# EAGLE design Classic-Narrow-5V-SIDE-USB (EAGLE 7.5.0)
Title: Classic Narrow 5V - Side USB Author: Lance Source: Alienflight.com License: CC BY SA <http://creativecommons.org/licenses/by-sa/4.0/>
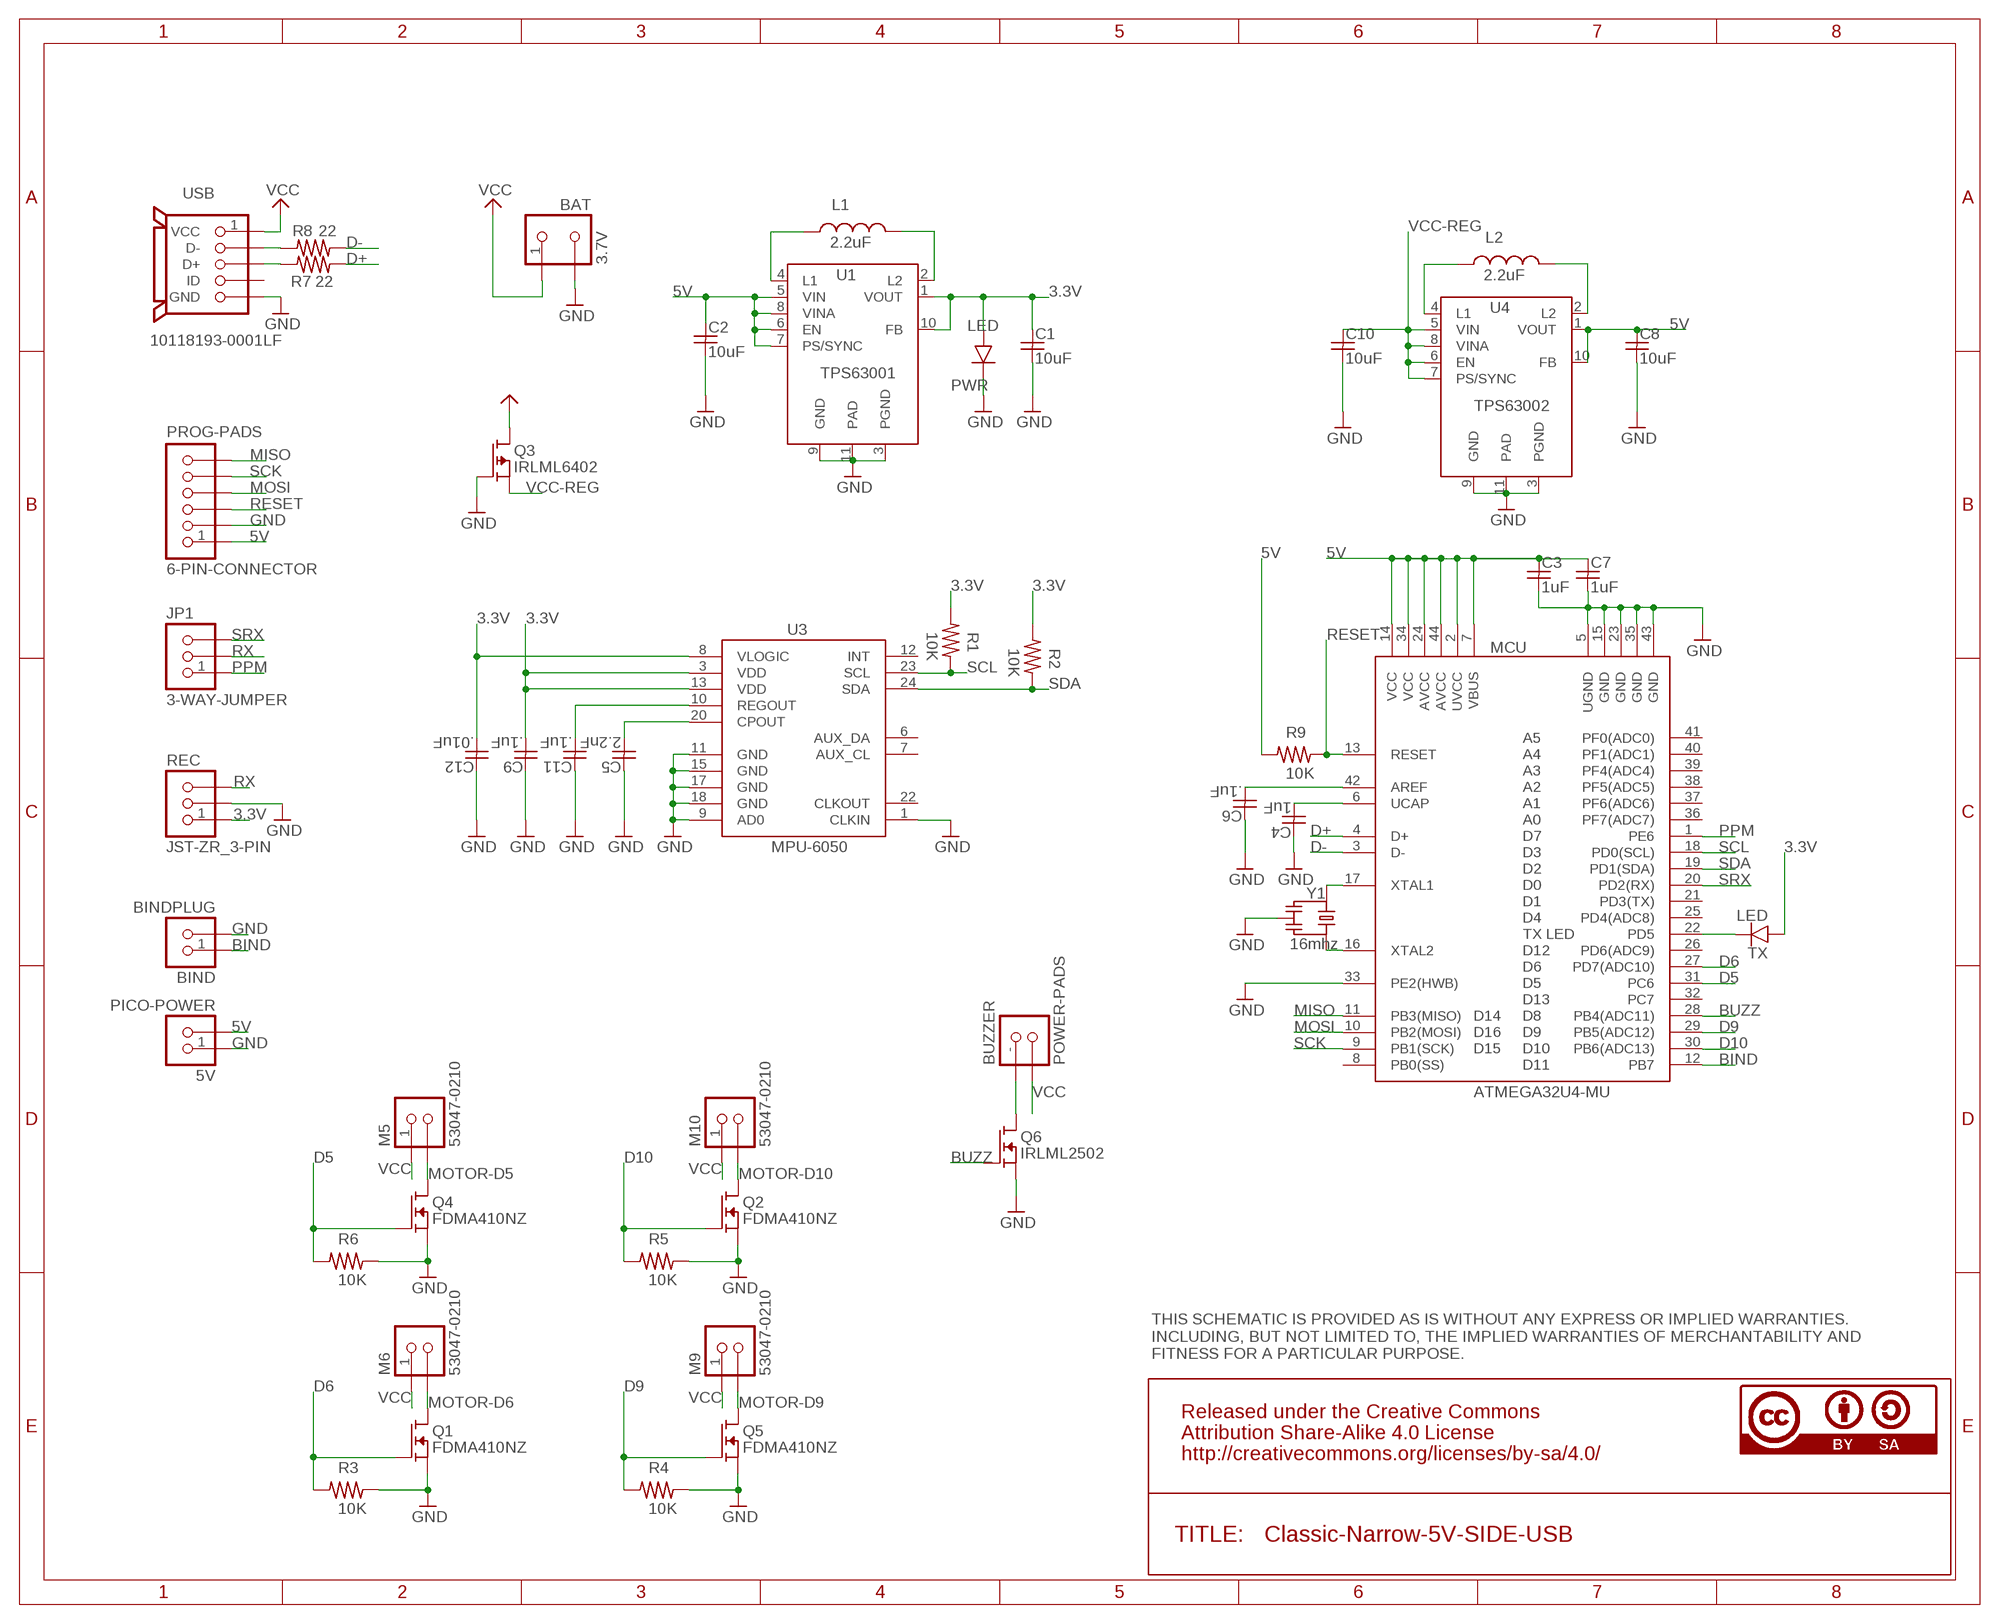
[diagram p0: schematic, sheet 1]

## Parts
5V  PICO-POWER  [PICO_1.25_.5MM]
BAT  3.7V  JST-PH-BAT  [S2B-PH-K-S]
BIND  BINDPLUG  TACTILE-SWITCH  [B3U-1000P(M)]
BUZZER  POWER-PADS  [POW-PADS]
C1  10uF  CAPACITOR10UF  [YUDEN-CAP-0805]
C2  10uF  CAPACITOR10UF  [YUDEN-CAP-0805]
C3  1uF  CAPACITOR1UF  [MUR-CAP-0603]
C4  1uF  CAPACITOR1UF  [MUR-CAP-0603]
C5  2.2nF  CAPACITOR2.2NF  [MUR-CAP-0603]
C6  .1uF  CAPACITOR.1UF  [MUR-CAP-0603]
C7  1uF  CAPACITOR1UF  [MUR-CAP-0603]
C8  10uF  CAPACITOR10UF  [YUDEN-CAP-0805]
C9  .1uF  CAPACITOR.1UF  [MUR-CAP-0603]
C10  10uF  CAPACITOR10UF  [YUDEN-CAP-0805]
C11  .1uF  CAPACITOR.1UF  [MUR-CAP-0603]
C12  .01uF  CAPACITOR.01UF  [MUR-CAP-0603]
JP1  3-WAY-JUMPER  [3-WAY-JUMPER]
L1  2.2uF  NR301X  [NR301X]
L2  2.2uF  NR301X  [NR301X]
M5  53047-0210  PICO-1.25-MOTOR  [PICO-53047-02]
M6  53047-0210  PICO-1.25-MOTOR  [PICO-53047-02]
M9  53047-0210  PICO-1.25-MOTOR  [PICO-53047-02]
M10  53047-0210  PICO-1.25-MOTOR  [PICO-53047-02]
MCU  ATMEGA32U4-MU  [QFN44-7X7]
PROG-PADS  6-PIN-CONNECTOR  [B6B-ZR]
PWR  LED  SMD-CHIP-LED-0805  [SMD-CHIP-LED-0805]
Q1  FDMA410NZ  [MICROFET-2X2]
Q2  FDMA410NZ  [MICROFET-2X2]
Q3  IRLML6402  MOSFET-P  [SOT-23]
Q4  FDMA410NZ  [MICROFET-2X2]
Q5  FDMA410NZ  [MICROFET-2X2]
Q6  IRLML2502  MOSFET-N2502  [SOT-23]
R1  10K  RESISTOR10K  [VISH-RES-0603]
R2  10K  RESISTOR10K  [VISH-RES-0603]
R3  10K  RESISTOR10K  [VISH-RES-0603]
R4  10K  RESISTOR10K  [VISH-RES-0603]
R5  10K  RESISTOR10K  [VISH-RES-0603]
R6  10K  RESISTOR10K  [VISH-RES-0603]
R7  22  RESISTOR22  [VISH-RES-0603]
R8  22  RESISTOR22  [VISH-RES-0603]
R9  10K  RESISTOR10K  [VISH-RES-0603]
REC  JST-ZR_3-PIN  [S3B-ZR]
TX  LED  SMD-CHIP-LED-0805  [SMD-CHIP-LED-0805]
U1  TPS63001  TPS630XX-TPS63001  [VSON-N10]
U3  MPU-6050  [QFN24-4X4]
U4  TPS63002  TPS630XX-TPS63002  [VSON-N10]
USB  10118193-0001LF  USB-MICRO-B-FCI  [10118193-0001LF]
Y1  16mhz  RESONATOR16MHZ  [RESONATOR_16]

## Nets
3.3V: C1.1 C9.2 C12.2 PWR.A R1.2 R2.2 REC.1 TX.A U1.1(VOUT) U1.10(FB) U3.3(VDD) U3.8(VLOGIC) U3.13(VDD)
5V: 5V.2 C2.1 C3.1 C7.1 C8.1 MCU.2(UVCC) MCU.7(VBUS) MCU.14(VCC) MCU.24(AVCC) MCU.34(VCC) MCU.44(AVCC) PROG-PADS.1 R9.2 U1.5(VIN) U1.6(EN) U1.7(PS/SYNC) U1.8(VINA) U4.1(VOUT) U4.10(FB)
AREF: C6.2 MCU.42(AREF)
BIND: BIND.1 MCU.12(PB7)
BUZZ: MCU.28(PB4(ADC11)) Q6.1(G)
D5: MCU.31(PC6) Q4.G R6.2
D6: MCU.27(PD7(ADC10)) Q1.G R3.2
D9: MCU.29(PB5(ADC12)) Q5.G R4.2
D10: MCU.30(PB6(ADC13)) Q2.G R5.2
D+: MCU.4(D+) R7.1
D-: MCU.3(D-) R8.1
GND: 5V.1 BAT.2 BIND.2 C1.2 C2.2 C3.2 C4.1 C5.1 C6.1 C7.2 C8.2 C9.1 C10.2 C11.1 C12.1 MCU.5(UGND) MCU.15(GND) MCU.23(GND) MCU.33(PE2(HWB)) MCU.35(GND) MCU.43(GND) PROG-PADS.2 PWR.C Q1.S Q1.S1(S) Q2.S Q2.S1(S) Q3.1(G) Q4.S Q4.S1(S) Q5.S Q5.S1(S) Q6.2(S) R3.1 R4.1 R5.1 R6.1 REC.2 U1.3(PGND) U1.9(GND) U1.11(PAD) U3.1(CLKIN) U3.9(AD0) U3.11(GND) U3.15(GND) U3.17(GND) U3.18(GND) U4.3(PGND) U4.9(GND) U4.11(PAD) USB.5(GND) USB.GND USB.GND2(GND) USB.HOLE1(GND) USB.HOLE2(GND) Y1.2
MISO: MCU.11(PB3(MISO)) PROG-PADS.6
MOSI: MCU.10(PB2(MOSI)) PROG-PADS.4
MOTOR-D5: M5.2 Q4.D Q4.D1(D) Q4.D2(D) Q4.D3(D) Q4.D4(D)
MOTOR-D6: M6.2 Q1.D Q1.D1(D) Q1.D2(D) Q1.D3(D) Q1.D4(D)
MOTOR-D9: M9.2 Q5.D Q5.D1(D) Q5.D2(D) Q5.D3(D) Q5.D4(D)
MOTOR-D10: M10.2 Q2.D Q2.D1(D) Q2.D2(D) Q2.D3(D) Q2.D4(D)
N$1: MCU.17(XTAL1) Y1.1
N$2: MCU.16(XTAL2) Y1.3
N$3: R7.2 USB.3(D+)
N$4: C4.2 MCU.6(UCAP)
N$5: C11.2 U3.10(REGOUT)
N$6: R8.2 USB.2(D-)
N$7: MCU.22(PD5) TX.C
N$8: C5.2 U3.20(CPOUT)
N$9: L1.2 U1.2(L2)
N$10: BUZZER.- Q6.3(D)
N$11: L1.1 U1.4(L1)
N$20: L2.2 U4.2(L2)
N$21: L2.1 U4.4(L1)
PPM: JP1.1 MCU.1(PE6)
RESET: MCU.13(RESET) PROG-PADS.3 R9.1
RX: JP1.2 REC.3
SCK: MCU.9(PB1(SCK)) PROG-PADS.5
SCL: MCU.18(PD0(SCL)) R1.1 U3.23(SCL)
SDA: MCU.19(PD1(SDA)) R2.1 U3.24(SDA)
SRX: JP1.3 MCU.20(PD2(RX))
VCC [vcc]: BAT.1 BUZZER.+ M5.1 M6.1 M9.1 M10.1 Q3.3(D) USB.1(VCC)
VCC-REG [vcc]: C10.1 Q3.2(S) U4.5(VIN) U4.6(EN) U4.7(PS/SYNC) U4.8(VINA)
Unconnected: MCU.8(PB0(SS)) MCU.21(PD3(TX)) MCU.25(PD4(ADC8)) MCU.26(PD6(ADC9)) MCU.32(PC7) MCU.36(PF7(ADC7)) MCU.37(PF6(ADC6)) MCU.38(PF5(ADC5)) MCU.39(PF4(ADC4)) MCU.40(PF1(ADC1)) MCU.41(PF0(ADC0)) U3.6(AUX_DA) U3.7(AUX_CL) U3.12(INT) U3.22(CLKOUT) USB.4(ID)

## Notes on the sheet
- THIS SCHEMATIC IS PROVIDED AS IS WITHOUT ANY EXPRESS OR IMPLIED WARRANTIES.
   INCLUDING, BUT NOT LIMITED TO, THE IMPLIED WARRANTIES OF MERCHANTABILITY AND
   FITNESS FOR A PARTICULAR PURPOSE.

## Library data of the parts
5V = alienflight:PICO-POWER: Pico Power Connector Picoblade 53047-0210 View Datasheet <http://www.molex.com/webdocs/datasheets/pdf/en-us/0530470210_PCB_HEADERS.pdf> Author: Lance Source: http://alienflight.com License: CC BY SA <creativecommons.org/licenses/by-sa/4.0/>; MF: Molex; MPN: 53047-0210
BAT = alienflight:JST-PH-BAT: Battery Connector JST- S2B-PH-K-S View Datasheet <http://www.jst-mfg.com/product/pdf/eng/ePH.pdf> Author: Lance Source: http://alienflight.com License: CC BY SA <creativecommons.org/licenses/by-sa/4.0/>; MF: JST; MPN: S2B-PH-K-S
BIND = alienflight:TACTILE-SWITCH: Tactile Switch B3U-1000P Datasheet <https://www.omron.com/ecb/products/pdf/en-b3u.pdf> Author: Lance Source: http://alienflight.com License: CC BY SA <creativecommons.org/licenses/by-sa/4.0/>; MF: Omron; MPN: B3U-1000P
BUZZER = alienflight:POWER-PADS: Power Pads Author: Lance Source: http://alienflight.com License: CC BY SA <creativecommons.org/licenses/by-sa/4.0/>
C1 C2 C8 C10 = alienflight:CAPACITOR: CAPACITORS Murata Datasheet <http://www.murata.com/~/media/webrenewal/support/library/catalog/products/capacitor/mlcc/c02e.ashx?la=en-us> Taiyo Yuden Datasheet <http://www.mouser.com/ds/2/396/mlcc11_hq_e-541564.pdf> Author: Lance Source: http://alienflight.com License: CC BY SA <creativecommons.org/licenses/by-sa/4.0/>; MF: Taiyo Yuden; MPN: JMK212AB7106KG-T
C3 C4 C7 = alienflight:CAPACITOR: CAPACITORS Murata Datasheet <http://www.murata.com/~/media/webrenewal/support/library/catalog/products/capacitor/mlcc/c02e.ashx?la=en-us> Taiyo Yuden Datasheet <http://www.mouser.com/ds/2/396/mlcc11_hq_e-541564.pdf> Author: Lance Source: http://alienflight.com License: CC BY SA <creativecommons.org/licenses/by-sa/4.0/>; MF: Murata; MPN: GRM188R71C105KA12D
C5 = alienflight:CAPACITOR: CAPACITORS Murata Datasheet <http://www.murata.com/~/media/webrenewal/support/library/catalog/products/capacitor/mlcc/c02e.ashx?la=en-us> Taiyo Yuden Datasheet <http://www.mouser.com/ds/2/396/mlcc11_hq_e-541564.pdf> Author: Lance Source: http://alienflight.com License: CC BY SA <creativecommons.org/licenses/by-sa/4.0/>; MF: Murata; MPN: GRM188R71C222KA01D
C6 C9 C11 = alienflight:CAPACITOR: CAPACITORS Murata Datasheet <http://www.murata.com/~/media/webrenewal/support/library/catalog/products/capacitor/mlcc/c02e.ashx?la=en-us> Taiyo Yuden Datasheet <http://www.mouser.com/ds/2/396/mlcc11_hq_e-541564.pdf> Author: Lance Source: http://alienflight.com License: CC BY SA <creativecommons.org/licenses/by-sa/4.0/>; MF: Murata; MPN: GRM188R71C104KA01D
C12 = alienflight:CAPACITOR: CAPACITORS Murata Datasheet <http://www.murata.com/~/media/webrenewal/support/library/catalog/products/capacitor/mlcc/c02e.ashx?la=en-us> Taiyo Yuden Datasheet <http://www.mouser.com/ds/2/396/mlcc11_hq_e-541564.pdf> Author: Lance Source: http://alienflight.com License: CC BY SA <creativecommons.org/licenses/by-sa/4.0/>; MF: Murata; MPN: GRM188R71C103KA01D
JP1 = alienflight:3-WAY-JUMPER: 3 Way Jumper
L1 L2 = alienflight:NR301X: 3X3mm Inductor NR3015T2R2M - Datasheet <http://datasheet.octopart.com/NR3015T2R2M-Taiyo-Yuden-datasheet-41181804.pdf> Author: Lance Source: http://alienflight.com License: CC BY SA <creativecommons.org/licenses/by-sa/4.0/>; MF: Taiyo Yuden; MPN: NR3015T2R2M
M5 M6 M9 M10 = alienflight:PICO-1.25-MOTOR: Motor Connector PicoBlade 1.25 53047-02 View Datasheet <http://www.molex.com/webdocs/datasheets/pdf/en-us/0530470210_PCB_HEADERS.pdf> Author: Lance Source: http://alienflight.com License: CC BY SA <creativecommons.org/licenses/by-sa/4.0/>; MF: MOLEX; MPN: 53047-0210
MCU = alienflight:ATMEGA32U4-MU: Atmega32U4-MU View Datasheet <http://www.atmel.com/images/atmel-7766-8-bit-avr-atmega16u4-32u4_datasheet.pdf> Author: Lance Source: http://alienflight.com License: CC BY SA <creativecommons.org/licenses/by-sa/4.0/>; MF: Atmel; MPN: Atmega32U4-MU
PROG-PADS = alienflight:6-PIN-CONNECTOR: 6-PIN CONNECTOR B6B-ZR(LF)(SN) View Datasheet <http://www.jst-mfg.com/product/pdf/eng/eZH.pdf> Author: Lance Source: http://alienflight.com License: CC BY SA <creativecommons.org/licenses/by-sa/4.0/>; MF: JST; MPN: B6B-ZR(LF)(SN)
PWR TX = alienflight:SMD-CHIP-LED-0805: SMD CHIP LED APHCM2012QBC/D-F01 View Datasheet <https://www.kingbrightusa.com/images/catalog/spec/APHCM2012QBC-D-F01.pdf> Author: Lance Source: http://alienflight.com License: CC BY SA <creativecommons.org/licenses/by-sa/4.0/>; MF: Kingbright; MPN: APHCM2012QBC/D-F01
Q1 Q2 Q4 Q5 = alienflight:FDMA410NZ: N-Channel MOSFET FDMA410NZ View Datasheet <https://www.fairchildsemi.com/datasheets/FD/FDMA410NZ.pdf> Author: Lance Source: http://alienflight.com License: CC BY SA <creativecommons.org/licenses/by-sa/4.0/>; MF: Fairchild; MPN: FDMA410NZ
Q3 = alienflight:MOSFET-P: P-Channel MOSFET IRLML6402 Datasheet <http://www.irf.com/product-info/datasheets/data/irlml6402pbf.pdf> Author: Lance Source: Alienflight.com License: CC BY SA <creativecommons.org/licenses/by-sa/4.0/>; MF: IR; MPN: IRLML6402
Q6 = alienflight:MOSFET-N: N-Channel MOSFET IRLML2502 Datasheet <http://www.irf.com/product-info/datasheets/data/irlml2502pbf.pdf> IRLML6244 Datasheet <http://www.irf.com/product-info/datasheets/data/irlml6244pbf.pdf> Author: Lance Source: http://alienflight.com License: CC BY SA <creativecommons.org/licenses/by-sa/4.0/>; MF: IR; MPN: IRLML2502
R1-R6 R9 = alienflight:RESISTOR: RESISTORS Vishay DataSheet <http://www.vishay.com/docs/20043/crcwhpe3.pdf> Author: Lance Source: http://alienflight.com License: CC BY SA <creativecommons.org/licenses/by-sa/4.0/>; MF: Vishay; MPN: CRCW060310K0FKEAHP
R7 R8 = alienflight:RESISTOR: RESISTORS Vishay DataSheet <http://www.vishay.com/docs/20043/crcwhpe3.pdf> Author: Lance Source: http://alienflight.com License: CC BY SA <creativecommons.org/licenses/by-sa/4.0/>; MF: Vishay; MPN: CRCW060322R0FKEAHP
REC = alienflight:JST-ZR_3-PIN: 3 Pin Receiver JST - S3B-ZR View Datasheet <http://www.jst-mfg.com/product/pdf/eng/eZH.pdf> Author: Lance Source: http://alienflight.com License: CC BY SA <creativecommons.org/licenses/by-sa/4.0/>; MF: JST; MPN: S3B-ZR
U1 = alienflight:TPS630XX: Buck/Boost Converter TPS63001/2 Datasheet <http://www.ti.com/lit/ds/symlink/tps63001.pdf> Author: Lance Source: http://alienflight.com License: CC BY SA <creativecommons.org/licenses/by-sa/4.0/>; MF: TI; MPN: TPS63001DRCR
U3 = alienflight:MPU-6050: MPU-6050 View Datasheet <http://43zrtwysvxb2gf29r5o0athu.wpengine.netdna-cdn.com/wp-content/uploads/2015/02/MPU-6000-Datasheet1.pdf> Author: Lance Source: http://alienflight.com License: CC BY SA <creativecommons.org/licenses/by-sa/4.0/>; MF: Invensense; MPN: MPU-6050
U4 = alienflight:TPS630XX: Buck/Boost Converter TPS63001/2 Datasheet <http://www.ti.com/lit/ds/symlink/tps63001.pdf> Author: Lance Source: http://alienflight.com License: CC BY SA <creativecommons.org/licenses/by-sa/4.0/>; MF: TI; MPN: TPS63002DRCR
USB = alienflight:USB-MICRO-B: Micro-B USB Connector Author: Lance Source: http://alienflight.com License: CC BY SA <creativecommons.org/licenses/by-sa/4.0/>; MF: FCI; MPN: 10118193-0001LF
Y1 = alienflight:RESONATOR: SMD Ceramic Resonators Ceralock Murata Datasheet <http://www.murata.com/~/media/webrenewal/support/library/catalog/products/timingdevice/ceralock/p16e.ashx> Author: Lance Source: http://alienflight.com License: CC BY SA <creativecommons.org/licenses/by-sa/4.0/>; MF: Murata; MPN: CSTCE16M0V53-R0

## Net classes
0 default: width 0.254 mm, drill 0.33 mm, clearance 0.178 mm
1 vcc: width 0.254 mm, drill 0.33 mm, clearance 0.178 mm
2 gnd: width 0.254 mm, drill 0.33 mm, clearance 0.178 mm

## Board
Title: Classic Narrow 5V - Side USB Author: Lance Source: Alienflight.com License: CC BY SA <http://creativecommons.org/licenses/by-sa/4.0/>
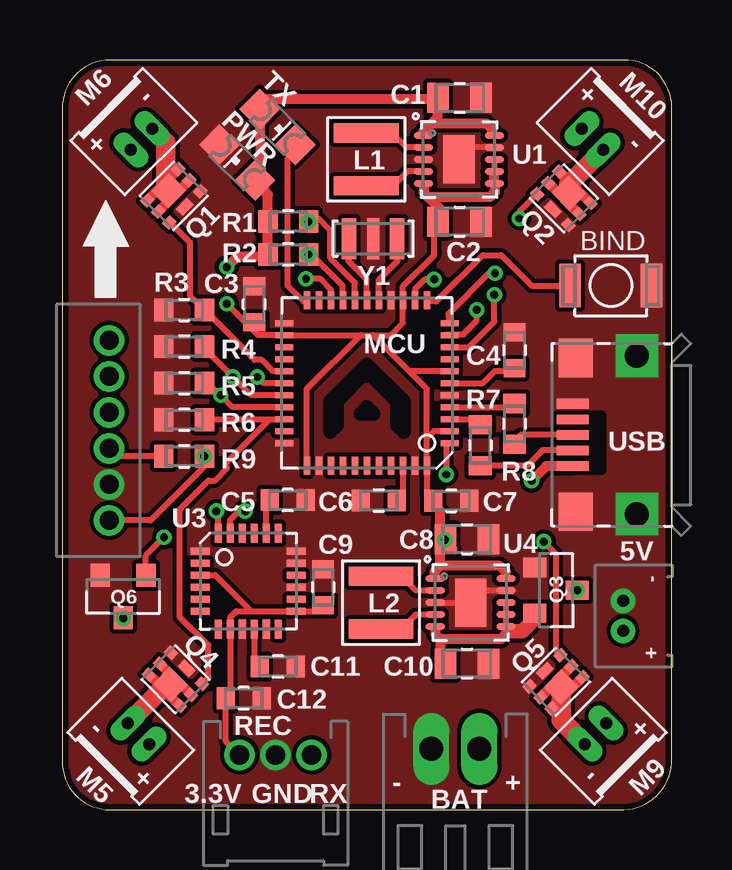
[diagram p1: board, top side]
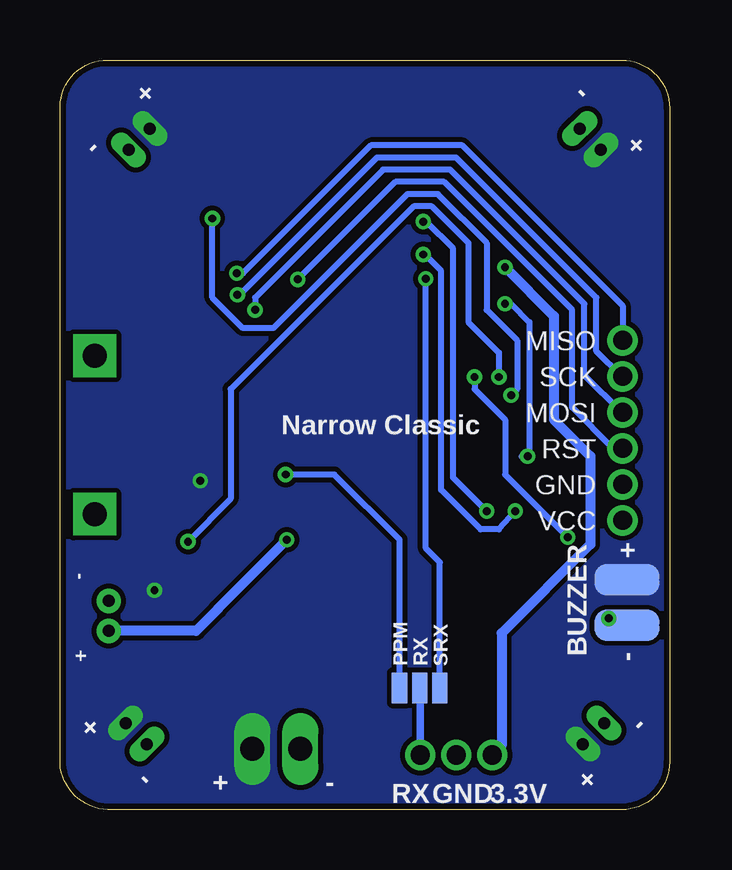
[diagram p2: board, bottom side, seen from below]

Size 25.4 x 31.24 mm. Coordinates in mm from the lower left corner, seen from the top.
Outline: 0,29.24 0,2 arc90 2,0 23.4,0 arc84 25.4,1.95 25.4,29.29 arc90 23.4,31.24 2,31.24 arc90 0,29.24
Copper layers (1*16): Top 0.035mm / dielectric 1.5mm / Bottom 0.035mm
Design rules "Alien-Design-Rules": minimum track width 6mil, minimum drill 12mil, track to track 6mil, track to pad 6mil, pad to pad 6mil, via to via 6mil, smd to smd 0mil, copper to edge 10mil, drill to drill 10mil, minimum pad ring 7mil, minimum via ring 6mil, stop-mask expansion 0mil, vias tented up to drill 20mil, thermal gap 10mil
tRestrict: area 11.2,15.7 to 14.2,18.5; area 12.4,16.5 to 13,16.8

### Footprints (pad centres in the part's own frame; a part is rotated, then mirrored left to right if it is on the bottom)
PICO_1.25_.5MM = drill 0.5 pad 1.016: 1 0.625,0; 2 -0.625,0
S2B-PH-K-S = drill 1 long: 1 1,0; 2 -1,0
B3U-1000P(M) = smd 0.9 x 1.8: 1 -1.7,0; 2 1.7,0
POW-PADS = smd 1.3 x 2.7: + 0.95,0; - -0.95,0
YUDEN-CAP-0805 = smd 0.9 x 1.25: 1 -0.9,0; 2 0.9,0
MUR-CAP-0603 = smd 0.75 x 0.9: 1 -0.75,0; 2 0.75,0
3-WAY-JUMPER = smd 0.635 x 1.27: 1 -0.84,0; 2 0,0; 3 0.84,0
NR301X = smd 2.7 x 0.8: 1 0,1.1; 2 0,-1.1
PICO-53047-02 = drill 0.5 pad 0.813 long: 1 0.625,0; 2 -0.625,0
QFN44-7X7 = smd 0.75 x 0.254: 1 -3.45,2.5; 2 -3.45,2; 3 -3.45,1.5; 4 -3.45,1; 5 -3.45,0.5; 6 -3.45,0; 7 -3.45,-0.5; 8 -3.45,-1; 9 -3.45,-1.5; 10 -3.45,-2; 11 -3.45,-2.5; 23 3.45,-2.5; 24 3.45,-2; 25 3.45,-1.5; 26 3.45,-1; 27 3.45,-0.5; 28 3.45,0; 29 3.45,0.5; 30 3.45,1; 31 3.45,1.5; 32 3.45,2; 33 3.45,2.5 | smd 0.254 x 0.75: 12 -2.5,-3.45; 13 -2,-3.45; 14 -1.5,-3.45; 15 -1,-3.45; 16 -0.5,-3.45; 17 0,-3.45; 18 0.5,-3.45; 19 1,-3.45; 20 1.5,-3.45; 21 2,-3.45; 22 2.5,-3.45; 34 2.5,3.45; 35 2,3.45; 36 1.5,3.45; 37 1,3.45; 38 0.5,3.45; 39 0,3.45; 40 -0.5,3.45; 41 -1,3.45; 42 -1.5,3.45; 43 -2,3.45; 44 -2.5,3.45
B6B-ZR = drill 0.8 pad 1.27: 1 3,0; 2 1.5,0; 3 0,0; 4 -1.5,0; 5 -3,0; 6 -4.5,0
SMD-CHIP-LED-0805 = smd 1.2 x 1.2: A -1.05,0; C 1.05,0
MICROFET-2X2 = smd 1 x 1.05: D -0.3,0 | smd 0.4 x 0.47: D1 -0.65,0.915; D2 0,0.915; D3 -0.65,-0.915; D4 0,-0.915; G 0.65,-0.915; S1 0.65,0.915 | smd 0.4 x 0.66: S 0.65,0
SOT-23 = smd 0.802 x 0.972: 1 -0.95,-0.885; 2 0.95,-0.885; 3 0,0.885
VISH-RES-0603 = smd 0.8 x 0.95: 1 -0.85,0; 2 0.85,0
S3B-ZR = drill 0.8 pad 1.27: 1 -1.5,0; 2 0,0; 3 1.5,0
VSON-N10 = smd 0.8 x 0.26: 1 -1.475,1; 2 -1.475,0.5; 3 -1.475,0; 4 -1.475,-0.5; 5 -1.475,-1; 6 1.475,-1; 7 1.475,-0.5; 8 1.475,0; 9 1.475,0.5; 10 1.475,1 | smd 1.3 x 2: 11 0,0
QFN24-4X4 = smd 0.8 x 0.3: 1 -2,1.25; 2 -2,0.75; 3 -2,0.25; 4 -2,-0.25; 5 -2,-0.75; 6 -2,-1.25; 13 2,-1.25; 14 2,-0.75; 15 2,-0.25; 16 2,0.25; 17 2,0.75; 18 2,1.25 | smd 0.3 x 0.8: 7 -1.25,-2; 8 -0.75,-2; 9 -0.25,-2; 10 0.25,-2; 11 0.75,-2; 12 1.25,-2; 19 1.25,2; 20 0.75,2; 21 0.25,2; 22 -0.25,2; 23 -0.75,2; 24 -1.25,2
10118193-0001LF = smd 0.4 x 1.35: 1 1.3,-4.125; 2 0.65,-4.125; 3 0,-4.125; 4 -0.65,-4.125; 5 -1.3,-4.125 | smd 1.6 x 1.4: GND -3.2,-4; GND2 3.2,-4 | drill 1 pad 1.778 square: HOLE1 -3.3,-1.45; HOLE2 3.3,-1.45
RESONATOR_16 = smd 0.6 x 1.7: 1 -1,0; 3 1,0 | smd 0.5 x 1.7: 2 0,0

### Placement (x,y rotation side)
5V  23.37,8.08 90 top
BAT  16.38,2.54 0 top
BIND  22.86,21.84 0 top
BUZZER  1.78,8.64 90 bottom
C1  16.56,29.66 0 top
C2  16.56,24.51 0 top
C3  8,21.06 90 top
C4  18.85,19.15 270 top
C5  9.4,12.9 180 top
C6  13.19,12.89 0 top
C7  16.21,12.88 0 top
C8  16.87,11.28 0 top
C9  10.87,9.27 270 top
C10  16.87,6.1 0 top
C11  8.99,5.97 180 top
C12  7.57,4.65 180 top
JP1  10.41,5.08 0 bottom
L1  12.67,27.1 180 top
L2  13.28,8.64 180 top
M5  3.17,3.17 315 top
M6  3.3,27.94 225 top
M9  22.23,3.17 45 top
M10  22.1,27.94 135 top
MCU  12.7,17.78 180 top
PROG-PADS  1.96,15.06 270 top
PWR  7.29,26.97 135 top
Q1  4.65,25.58 315 top
Q2  20.9,25.47 225 top
Q3  20.57,9.14 270 top
Q4  4.72,5.44 45 top
Q5  20.57,5.33 135 top
Q6  2.54,8.89 180 top
R1  9.42,24.51 180 top
R2  9.42,23.14 180 top
R3  5.08,20.83 0 top
R4  5.08,19.3 0 top
R5  5.08,17.78 0 top
R6  5.08,16.26 0 top
R7  18.85,16.08 270 top
R8  17.42,15.19 270 top
R9  5.08,14.73 0 top
REC  8.89,2.29 0 top
TX  8.97,28.45 315 top
U1  16.53,27.1 0 top
U3  7.75,9.52 0 top
U4  17.02,8.64 0 top
U$1  [ARROW]  1.78,22.86 0 top
USB  25.4,15.62 270 top
Y1  12.95,23.8 0 top

### Tracks (layer width: path | path; a pad name or v marks a point on that pad's centre or on a via)
3.3V  (via drill 0.33)
  Top 0.254: 17.93,28.2 U1.10 | U1.1 15.03,28.24 | 7.87,8.27 7.26,8.27 7,8.01 U3.8 7,4.83 C12.2 6.82,2.86 REC.1 | 7.87,8.27 U3.13 10.52,8.27 C9.2 | U3.3 6.37,9.77 7.87,8.27 | 8.66,24.28 R1.2
  Top 0.406: 17.93,28.2 17.93,28.34 17.68,28.6 15.39,28.6 | 15.03,28.24 15.39,28.6 | 15.39,28.6 15.64,28.85 15.64,29.61 8.17,29.61 TX.A 8.25,26.5 PWR.A 8.57,25.64 R1.2 R2.2 | 15.64,29.73 C1.1 | 8.64,23.13 R2.2 | R2.2 8.48,23.05 7.3,23.05 v6.86,22.61
  Top 0.61: 15.64,29.61 15.64,29.73
  Bottom 0.406: v6.86,22.61 4.83,20.57 4.83,16.26 3.3,14.73 3.3,11.06 7,7.37 7,2.68 REC.1
5V  (via drill 0.33)
  Top 0.254: U4.1 15.52,9.78 | U4.10 18.49,9.66 18.49,9.7 | U1.8 U1.7 | U1.5 15.06,26.01 | U1.6 18.03,26.06 18.03,26.01 | 12.45,19.78 MCU.24 8.16,19.78 7.87,20.07 | 12.45,19.78 12.95,19.78 | 12.95,19.78 13.68,19.78 14.2,20.3 MCU.14 14.2,21.82 15.49,23.11 15.49,24.34 C2.1 | C7.1 15.2,13.13 MCU.44 15.2,15.49 | R9.2 v5.92,14.73 5.92,14.3 3.68,12.06 PROG-PADS.1 | MCU.34 10.2,17.53 12.45,19.78 | 15.2,15.49 15.2,17.53 14.45,18.28 | 14.45,18.28 12.95,19.78 | MCU.7 14.45,18.28 | MCU.2 15.49,15.78 15.2,15.49 | 7.87,20.07 v6.86,21.08 | C3.1 8,20.19 7.87,20.07
  Top 0.406: 15.75,10.16 18.24,10.16 18.49,9.91 18.49,9.7 | 15.52,9.78 15.52,9.93 15.75,10.16 | 15.75,10.16 15.75,11.24 | 15.75,11.24 C8.1 16.26,10.86 v15.95,11.25 | 15.06,26.01 15.06,25.73 15.26,25.52 | 18.03,26.01 18.03,25.73 17.83,25.52 15.26,25.52 | U1.6 U1.7 | 15.26,25.52 15.74,25.04 15.66,24.95 C2.1 | 15.75,11.24 15.75,12.43 C7.1
  Bottom 0.254: 6.17,14.72 v5.92,14.73 R9.2 5.84,14.9 5.84,20.32 6.6,21.08 v6.86,21.08
  Bottom 0.406: v15.95,11.25 18.82,8.38 18.82,8.36 19.73,7.45 5V.2
AREF
  Top 0.254: MCU.42 14.2,13.15 C6.2
BIND
  Top 0.254: MCU.12 15.59,21.18 17.53,23.11 18.29,23.11 19.56,21.84 BIND.1
BUZZ  (via drill 0.33)
  Top 0.254: MCU.28 8.38,17.78 v8.13,18.03 | Q6.1 3.49,10.6 v4.24,11.35
  Bottom 0.254: v8.13,18.03 8.13,17.53 6.86,16.26 6.86,13.97 v4.24,11.35
D5
  Top 0.254: MCU.31 9.28,16.26 8.64,16.26 | 8.64,16.26 R6.2 | 8.64,16.26 6.86,14.48 6.86,14.22 6.35,13.72 6.1,13.72 4.9,12.52 4.9,8.03 6.1,6.86 6.1,5.52 Q4.G
D6
  Top 0.254: R3.2 5.33,21.42 5.33,23.62 4.48,24.47 Q1.G | 6.18,20.57 R3.2 | MCU.27 8.77,18.28 8.31,18.74 8.01,18.74 R3.2
D9  (via drill 0.33)
  Top 0.254: v20.07,11.18 20.57,10.67 20.57,6.63 Q5.G | MCU.29 7.87,17.28 v7.11,18.03 5.93,19.22 R4.2 6.1,19.3
  Bottom 0.254: v20.07,11.18 18.29,12.95 18.29,17.53 10.67,25.15 9.91,25.15 8.38,23.62 8.38,20.32 7.11,19.05 v7.11,18.03
D10  (via drill 0.33)
  Top 0.254: MCU.30 7.1,16.78 v6.6,17.27 6.1,17.78 R5.2 | v19.05,24.64 19.05,24.92 Q2.G
  Bottom 0.254: v19.05,24.64 19.05,21.34 17.78,20.07 16.51,20.07 10.92,25.65 9.65,25.65 7.62,23.62 7.62,20.83 6.35,19.56 6.35,17.53 v6.6,17.27
D+
  Top 0.254: MCU.4 18.6,16.78 R7.1
D-
  Top 0.254: MCU.3 17.08,16.28 R8.1
GND
  Top 0.254: U4.9 17.52,9.14 U4.11 U4.3 | U1.9 16.91,27.6 16.91,27.58 16.53,27.58 U1.11
  Top 0.61: 17.61,11.18 C8.2
  pour Top (isolate 0.178, no thermals): 1.75,-0.13 23.72,-0.13 arc90 25.5,1.65 25.5,29.46 arc90 23.72,31.24 1.75,31.24 arc90 -0.03,29.46 -0.03,1.65 arc90
MISO  (via drill 0.33)
  Top 0.254: MCU.11 16.1,20.67 17.78,22.35 v18.03,22.35
  Bottom 0.254: v18.03,22.35 17.78,22.35 12.45,27.69 8.64,27.69 1.96,21.01 PROG-PADS.6
MOSI  (via drill 0.33)
  Top 0.254: MCU.10 16.03,19.78 16,19.81 16.71,19.81 17.27,20.37 v17.27,20.83
  Bottom 0.254: v17.27,20.83 17.27,21.34 11.94,26.67 9.14,26.67 3.56,21.08 3.56,18.11 2,16.56 PROG-PADS.4
MOTOR-D5
  Top 0.406: Q4.D3 | Q4.D4 4.93,5.23 Q4.D | Q4.D2 4.51,5.65 Q4.D | Q4.D1 4.01,5.23 Q4.D | Q4.D3 4.35,4.89 4,4.89
  Top 0.813: M5.2 4,4.89 4.34,5.23 Q4.D
MOTOR-D6
  Top 0.406: 4.86,25.79 Q1.D | Q1.D 4.43,26.29 Q1.D1 Q1.D3 | Q1.D2 4.86,25.79 | 4.86,25.79 Q1.D | Q1.D4 4.43,25.37 Q1.D
  Top 0.813: M6.2 4.32,27.81 4.32,25.79 Q1.D
MOTOR-D9
  Top 0.406: Q5.D3 | Q5.D3 20.79,4.63 | 20.79,4.63 20.79,4.57 | Q5.D1 20.79,4.63 | 20.79,4.63 Q5.D | Q5.D2 20.36,5.12 Q5.D | Q5.D4 20.79,5.55 Q5.D
  Top 0.813: M9.2 20.79,3.73 20.79,4.57 Q5.D
MOTOR-D10
  Top 0.406: Q2.D3 | Q2.D3 21.07,26.23 21.27,26.23 21.27,26.03 Q2.D1 | Q2.D2 21.11,25.26 Q2.D 20.69,25.69 Q2.D4
  Top 0.813: M10.2 21.27,26.23 21.11,26.07 Q2.D
N$1
  Top 0.254: MCU.17 12.7,22.1 11.94,22.86 11.94,23.78 Y1.1
N$2
  Top 0.254: MCU.16 13.2,22.09 13.97,22.86 13.97,23.78 Y1.3
N$3
  Top 0.254: USB.3 19.09,15.62 R7.2
N$4
  Top 0.254: MCU.6 17.53,17.78 18.03,18.29 18.73,18.29 C4.2
N$5
  Top 0.254: U3.10 8,6.21 C11.2
N$6
  Top 0.254: 17.56,14.48 R8.2 19.37,14.34 20.02,14.99 20.87,14.99 USB.2
N$7
  Top 0.254: MCU.22 10.06,21.18 9.4,21.84 9.4,27.11 TX.C
N$8
  Top 0.254: U3.20 8.5,12.7 C5.2
N$9
  Top 0.254: U1.2 14.36,27.6 13.87,28.09 12.79,28.09 L1.2
N$10  (via drill 0.33)
  Top 0.254: Q6.3 2.56,7.73 v2.54,7.98
  Bottom 0.254: v2.54,7.98 2.14,7.72 1.85,7.69 BUZZER.-
N$11
  Top 0.254: U1.4 14.41,26.6 13.87,26.06 12.73,26.06 L1.1
N$20
  Top 0.254: U4.2 14.74,9.14 14.22,9.65 13.37,9.65 L2.2
N$21
  Top 0.254: U4.4 14.74,8.14 14.22,7.62 13.37,7.62 L2.1
PPM  (via drill 0.33)
  Top 0.254: MCU.1 16,15.18 v16,13.97
  Bottom 0.254: v16,13.97 13.97,13.97 11.25,11.25 JP1.1
RESET  (via drill 0.33)
  Top 0.254: v15.49,22.1 15.11,22.1 14.7,21.68 MCU.13 | R9.1 2.29,14.73 PROG-PADS.3
  Bottom 0.254: v15.49,22.1 11.43,26.16 9.4,26.16 4.06,20.83 4.06,16.76 2.36,15.06 PROG-PADS.3
RX
  Bottom 0.254: JP1.2 10.39,4.8
  Bottom 0.305: 10.39,4.8 REC.3
SCK  (via drill 0.33)
  Top 0.254: MCU.9 16.94,19.28 18.01,20.34 v18.01,21.46
  Bottom 0.254: v18.01,21.46 17.91,21.46 12.19,27.18 8.89,27.18 3.05,21.34 3.05,19.11 2,18.06 PROG-PADS.5
SCL  (via drill 0.33)
  Top 0.254: R1.1 10.33,24.65 v10.26,24.51 10.26,24.64 10.67,24.64 11.18,24.13 11.18,22.99 12.19,21.97 12.19,21.19 MCU.18 | U3.23 7,12.08 7.37,12.45 v7.62,12.45
  Bottom 0.254: v7.62,12.45 9.02,13.84 9.02,23.39 10.13,24.51 v10.26,24.51
SDA  (via drill 0.33)
  Top 0.254: MCU.19 11.68,21.2 11.68,21.84 10.25,23.28 R2.1 10.16,23.2 v10.26,23.14 | U3.24 6.5,12.3 v6.43,12.45
  Bottom 0.254: v6.43,12.45 7.11,11.68 7.87,11.68 9.53,13.33 9.53,22.45 10.21,23.14 v10.26,23.14
SRX  (via drill 0.33)
  Top 0.254: MCU.20 11.2,21.67 10.74,22.12 v10.16,22.12
  Bottom 0.254: v10.16,22.12 10.16,10.9 9.57,10.31 JP1.3
VCC  (via drill 0.33)
  Top 0.406: USB.1 20.16,14.32 v19.56,13.72 | Q3.3
  other vias: 21.46,9.14
  pour Bottom (isolate 0.203, no thermals): 1.75,-0.13 23.72,-0.13 arc90 25.5,1.65 25.5,29.46 arc90 23.72,31.24 1.75,31.24 arc90 -0.03,29.46 -0.03,1.65 arc90
VCC-REG
  Top 0.254: U4.5 15.54,7.57 15.54,7.52 | U4.6 U4.7 U4.8
  Top 0.406: 18.69,7.44 U4.6 | U4.6 18.49,7.32 | U4.6 18.49,7.31 18.29,7.11 15.75,7.11 | 15.54,7.52 15.54,7.31 15.75,7.11 | 15.75,7.11 15.75,6.06 C10.1 | Q3.2 19.69,7.97
  Top 0.61: 18.69,7.44 19.16,7.44 19.69,7.97

### Text on the board
bPlace: Narrow Classic | SRX | RX | PPM
Guide: Released under the Creative Commons Attribution Share-Alike 4.0 License / http://creativecommons.org/licenses/by-sa/4.0/ | THIS BOARD DESIGN IS PROVIDED AS IS WITHOUT ANY EXPRESS OR IMPLIED WARRANTIES. / INCLUDING, BUT NOT LIMITED TO, THE IMPLIED WARRANTIES OF MERCHANTABILITY AND / FITNESS FOR A PARTICULAR PURPOSE.